# Altium schematic sheet tm4c123_dev_board.SchDoc
size A
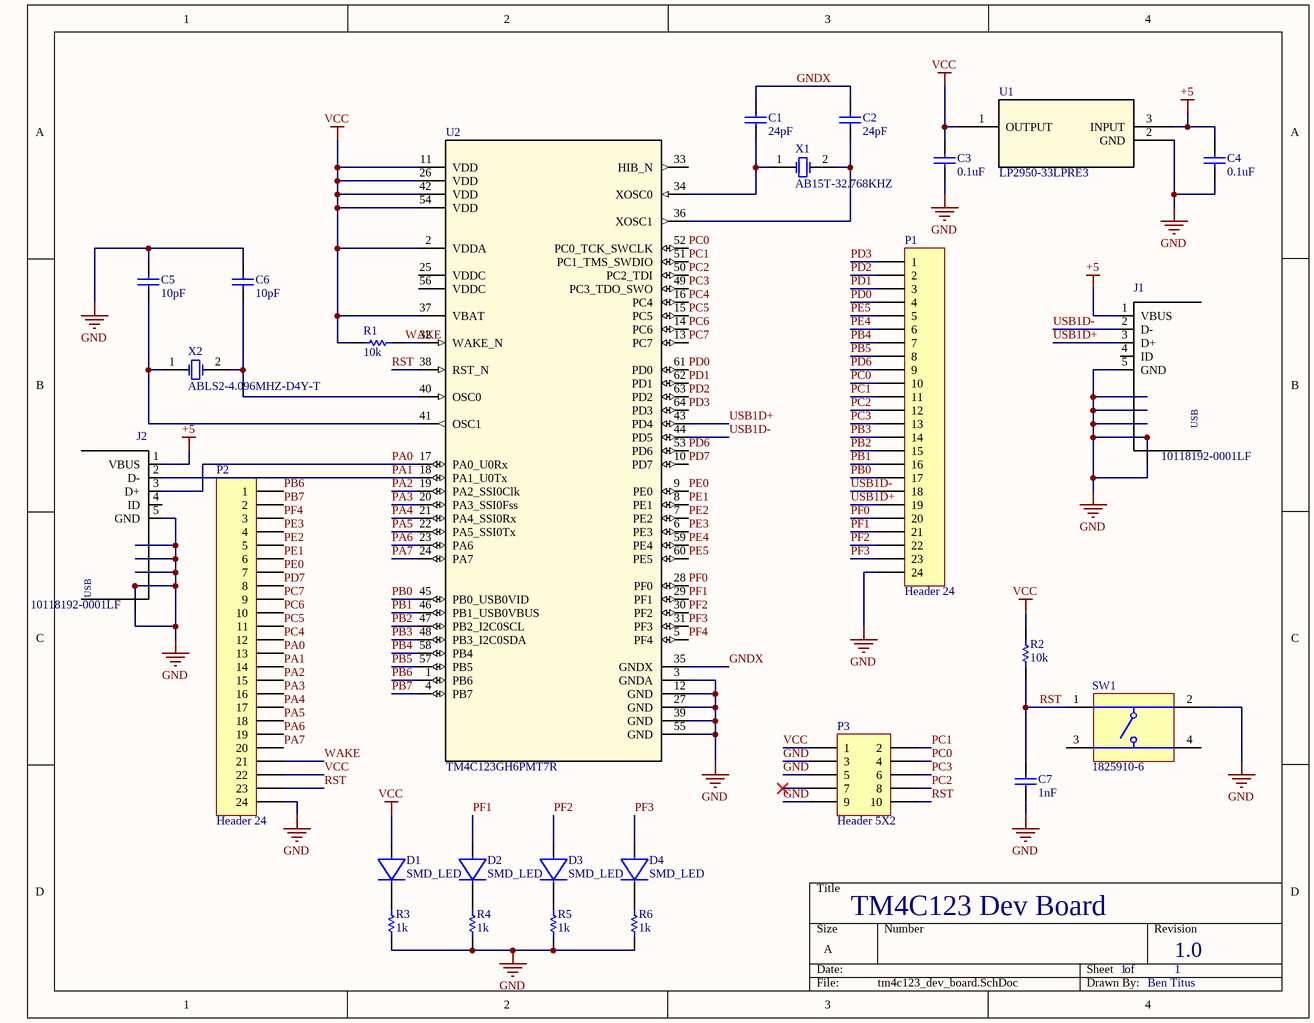
[diagram p0: tm4c123_dev_board.SchDoc]

## Parts
C1  24pF  [CAPC0805(2012)145_L]
C2  24pF  [CAPC0805(2012)145_L]
C3  0.1uF  [CAPC0805(2012)145_L]
C4  0.1uF  [CAPC0805(2012)145_L]
C5  10pF  [CAPC0805(2012)145_L]
C6  10pF  [CAPC0805(2012)145_L]
C7  1nF  [CAPC0805(2012)145_L]
D1  SMD_LED  [0805 Diode]
D2  SMD_LED  [0805 Diode]
D3  SMD_LED  [0805 Diode]
D4  SMD_LED  [0805 Diode]
J1  10118192-0001LF  [10118192-0001LF_10118192-0001LF(Primary)]
J2  10118192-0001LF  [10118192-0001LF_10118192-0001LF(Primary)]
P1  Header 24  [HDR1X24]
P2  Header 24  [HDR1X24]
P3  Header 5X2  [HDR2X5]
R1  10k  [RESC0805(2012)_L]
R2  10k  [RESC0805(2012)_L]
R3  1k  [RESC0805(2012)_L]
R4  1k  [RESC0805(2012)_L]
R5  1k  [RESC0805(2012)_L]
R6  1k  [RESC0805(2012)_L]
SW1  1825910-6  [TECO-1825910-6_V]
U1  LP2950-33LPRE3  [LP3]
U2  TM4C123GH6PMT7R  [PM0064A_N]
X1  AB15T-32.768KHZ  [ABRA-AB15T-2_V]
X2  ABLS2-4.096MHZ-D4Y-T  [ABRA-ABLS2-2_V]

## Nets
+5: C4.2 J1.1(VBUS) J2.1(VBUS) U1.3(INPUT)
GND: C3.1 C4.1 C5.2 C6.2 C7.1 J1.5(GND) J1.M1(S) J1.M2(S) J1.S1(S) J1.S2(S) J1.S3(S) J1.S4(S) J2.5(GND) J2.M1(S) J2.M2(S) J2.S1(S) J2.S2(S) J2.S3(S) J2.S4(S) P1.24 P2.24 P3.3 P3.5 P3.9 R3.1 R4.1 R5.1 R6.1 SW1.2 U1.2(GND) U2.3(GNDA) U2.12(GND) U2.27(GND) U2.39(GND) U2.55(GND)
VCC: C3.2 D1.1 P2.22 P3.1 R1.1 R2.2 U1.1(OUTPUT) U2.2(VDDA) U2.11(VDD) U2.26(VDD) U2.37(VBAT) U2.42(VDD) U2.54(VDD)
GNDX: C1.2 C2.2 U2.35(GNDX)
PA0: J2.3(D+) P2.13 U2.17(PA0_U0Rx)
PA1: J2.2(D-) P2.14 U2.18(PA1_U0Tx)
PA2: P2.15 U2.19(PA2_SSI0Clk)
PA3: P2.16 U2.20(PA3_SSI0Fss)
PA4: P2.17 U2.21(PA4_SSI0Rx)
PA5: P2.18 U2.22(PA5_SSI0Tx)
PA6: P2.19 U2.23(PA6)
PA7: P2.20 U2.24(PA7)
PB0: P1.17 U2.45(PB0_USB0VID)
PB1: P1.16 U2.46(PB1_USB0VBUS)
PB2: P1.15 U2.47(PB2_I2C0SCL)
PB3: P1.14 U2.48(PB3_I2C0SDA)
PB4: P1.7 U2.58(PB4)
PB5: P1.8 U2.57(PB5)
PB6: P2.1 U2.1(PB6)
PB7: P2.2 U2.4(PB7)
PC0: P1.10 P3.4 U2.52(PC0_TCK_SWCLK)
PC1: P1.11 P3.2 U2.51(PC1_TMS_SWDIO)
PC2: P1.12 P3.8 U2.50(PC2_TDI)
PC3: P1.13 P3.6 U2.49(PC3_TDO_SWO)
PC4: P2.12 U2.16(PC4)
PC5: P2.11 U2.15(PC5)
PC6: P2.10 U2.14(PC6)
PC7: P2.9 U2.13(PC7)
PD0: P1.4 U2.61(PD0)
PD1: P1.3 U2.62(PD1)
PD2: P1.2 U2.63(PD2)
PD3: P1.1 U2.64(PD3)
PD6: P1.9 U2.53(PD6)
PD7: P2.8 U2.10(PD7)
PE0: P2.7 U2.9(PE0)
PE1: P2.6 U2.8(PE1)
PE2: P2.5 U2.7(PE2)
PE3: P2.4 U2.6(PE3)
PE4: P1.6 U2.59(PE4)
PE5: P1.5 U2.60(PE5)
PF0: P1.20 U2.28(PF0)
PF1: D2.1 P1.21 U2.29(PF1)
PF2: D3.1 P1.22 U2.30(PF2)
PF3: D4.1 P1.23 U2.31(PF3)
PF4: P2.3 U2.5(PF4)
RST: C7.2 P2.23 P3.10 R2.1 SW1.1 U2.38(RST_N)
USB1D+: J1.3(D+) P1.19 U2.43(PD4)
USB1D-: J1.2(D-) P1.18 U2.44(PD5)
WAKE: P2.21 R1.2 U2.32(WAKE_N)
NetC1_1: C1.1 U2.34(XOSC0) X1.1(X1)
NetC2_1: C2.1 U2.36(XOSC1) X1.2(X2)
NetC5_1: C5.1 U2.41(OSC1) X2.1(X1)
NetC6_1: C6.1 U2.40(OSC0) X2.2(X2)
NetD1_2: D1.2 R3.2
NetD2_2: D2.2 R4.2
NetD3_2: D3.2 R5.2
NetD4_2: D4.2 R6.2

Not connected (* = marked no-connect by the designer): J1 4(ID); J2 4(ID); P3 7*; SW1 3 4; U2 25(VDDC) 33(HIB_N) 56(VDDC)

## Notes on the sheet
- TM4C123 Dev Board
- 1
- 1.0
- Ben Titus
- (in symbol 10118192-0001LF) USB

## Library data of the parts
C1-C7 = CMP-1590-00003-1: 0805 (2012 Metric) Chip Capacitor; Case-EIA: 0805; Case-Metric: 2012; PackageReference: CAPC0805(2012)145
J1 J2 = 10118192-0001LF: CONN USB MICRO B RECPT SMT R/A; MF: Amphenol; Package: None; Price: 0.22 USD; MP: 10118192-0001LF; Availability: Good; Value: *
P1 P2 = Header 24: Header, 24-Pin; LatestRevisionDate: 17-Jul-2002; LatestRevisionNote: Re-released for DXP Platform.; Publisher: Altium Limited
P3 = Header 5X2: Header, 5-Pin, Dual row; LatestRevisionDate: 17-Jul-2002; LatestRevisionNote: Re-released for DXP Platform.; Publisher: Altium Limited
R1-R6 = CMP-1591-00002-1: 0805 (2012 Metric) Chip Resistor; Case-EIA: 0805; Case-Metric: 2012; PackageReference: RESC0805(2012)
SW1 = CMP-1684-00021-1: Tact Switch, SPST-NO, 0.05 A, -35 to 85 degC, 4-Pin THD, RoHS, Bulk; Manufacturer: TE Connectivity; Maximum Contact Resistance: 100mOhm; Mechanical Life: 100000Cycles; Bushing Type: Unthreaded; Switch Configuration: OFF(ON); Maximum DC Voltage Rating: 24V; Contact Rating @ Voltage: 0.05A@24VDC; Actuator Color: Black; Body Orientation: Straight; Function: MomentaryContact; Illumination: N/R; Actuator Style: RoundButton; Actuator Material: PolybutyleneTerephthalate; Dielectric Strength: 500VAC; Pole Throw Configuration: SPST; Actuator Length: 1.4mm; Product Weight: N/A; Contact Material: CopperAlloy; Housing Material: N/A; Terminal Type: PCPins; Minimum Insulation Resistance: 100MOhm; Package Description: 4-Pin Through Hole Device, Body 5.99 x 5.99 mm, Pitch 6.5 mm; Part No: 1825910-6; Package Reference: THD; Base Material: N/A; Manufacturer URL: http://www.te.com; Contact Plating: Silver; RoHS: Yes; Datasheet Version: Rev. C9; Electrical Life: 100000Cycles; Maximum AC Voltage Rating: N/A; Thread Size: N/R; Operating Temperature: -35to85C; Mounting: ThroughHole; Dimension: 5.99x5mm; Datasheet URL: http://www.te.com/commerce/DocumentDelivery/DDEController?Action=showdoc&DocId=Customer+Drawing%7F1825910%7FC9%7Fpdf%7FEnglish%7FENG_CD_1825910_C9.pdf%7F1825910-6; Family: 1825910; Seal Location: N/A; Seal Description: N/A; Packaging: N/A
U1 = LP2950-33LPRE3: Imported; Manufacturer: Texas Instruments; Built_By: EMA_UL_Team; C: Copyright (C) 2015 Accelerated Designs. All rights reserved; Vendor: Texas Instruments; Manufacturer_Part_Number: LP2950-33LPRE3; Value: Value; Type: Type; RefDes: RefDes
U2 = TM4C123GH6PMT7R: Imported; PartNumber: TM4C123GH6PMTR; Manufacturer: Texas Instruments; CompType: IC; PIN_COUNT: 64; Application_BuildNumber: *; Alternate_PartNumber: TM4C123GH6PMT; PackageReference: PM0064A; MountType: SMT; RoHS: Y; RefDes: RefDes; TYPE: TYPE; Value: Value
X1 = CMP-1326-00001-1: Low Frequency Cylindrical Watch Crystal, 32.768 kHz, -20 to 70 degC, 2-Pin 5 x 1.4 x 1.5 mm THD, RoHS, Bulk; Manufacturer: Abracon; ESR: 40 KOhm Max.; Shunt Capacitance C0: 1 pF Typ.; Load Capacitance CL: 12.5 pF; ComponentLink1URL: http://www.abracon.com/; Temperature Range: -20 to 70 degC; ComponentLink1Description: Manufacturer URL; PackageDescription: 2-Pin THD, Body 5 x 1.4 mm, Pin Spacing 0.45 mm; Frequency: 32.768 kHz; ComponentLink2URL: http://www.abracon.com/Resonators/AB15T.pdf; ComponentLink2Description: Datasheet; ComponentLink3Description: Package Specification; DatasheetVersion: Jun-10; Packing: Bulk; Mounting Technology: Through Hole; RoHS: TRUE; PartNumber: AB15T-32.768KHZ; ComponentLink3URL: http://www.abracon.com/Resonators/AB15T.pdf
X2 = CMP-0277-00002-1: Low Profile Surface Mount Microprocessor Crystal, 4.096 MHz +/-30 ppm, 180 Ohm, -40 to 85 degC, 2-Pin 11.4 x 4.7 x 3.3 mm SMD, RoHS, Tape and Reel; Manufacturer: Abracon; Operation Mode: Fundamental or 3rd Overtone; Shunt Capacitance: 7 pF Max.; ESR: 180 Ohm; Load Capacitance: 18 pF; Mounting Technology: Surface Mount; PackageDescription: 2-Pin SMD, Body 11.4 x 4.7 mm, Height 3.3 mm; ComponentLink1URL: http://www.abracon.com/; Freq. Stability: +/- 30 ppm; ComponentLink2Description: Datasheet; PartNumber: ABLS2-4.096MHZ-D4Y-T; Operating Temp. Range: -40 to 85 degC; Packing: Tape and Reel; RoHS: TRUE; PackageReference: ABLS2-2; DatasheetVersion: Rev. 03.31.11; Freq. Tolerance: +/- 30 ppm; Frequency: 4.096 MHz; ComponentLink2URL: http://www.abracon.com/Resonators/ABLS2.pdf; ComponentLink1Description: Manufacturer URL